# Altium schematic sheet Sensor.SchDoc
size A4
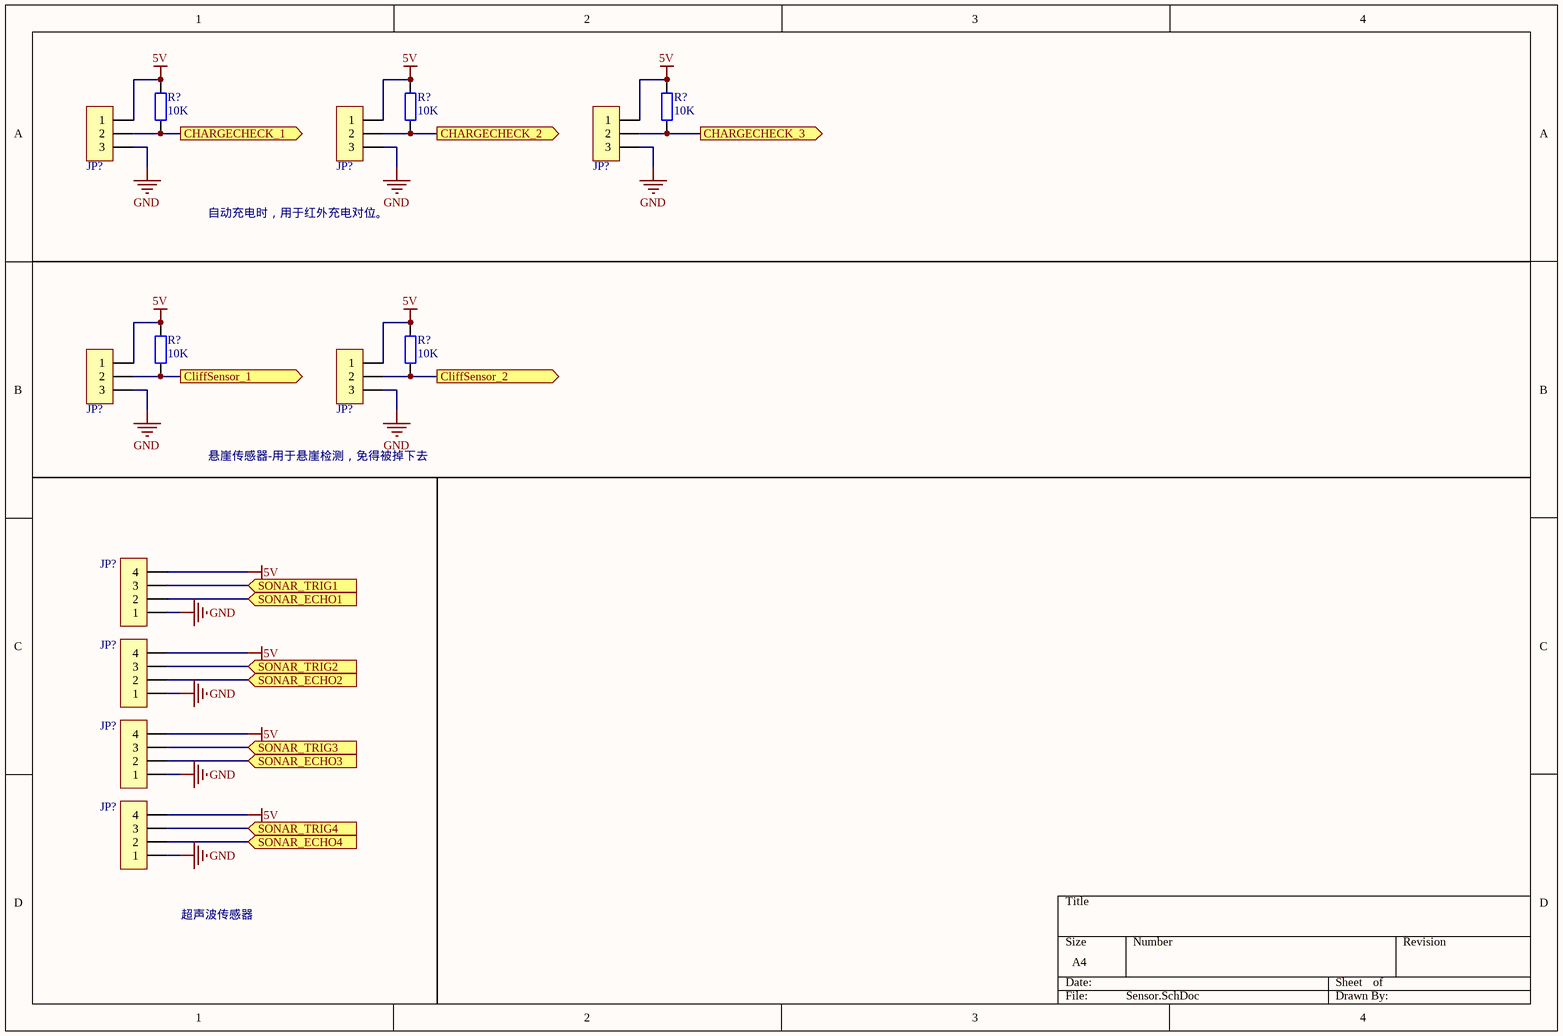
[diagram p0: Sensor.SchDoc]

## Parts
(Parts that share a designator on the sheet are numbered #1, #2 ... from top to bottom, then left to right.)
JP?#1  HDR-1X3  [XH2.54-LI-3P]  (value not drawn)
JP?#2  HDR-1X3  [XH2.54-LI-3P]  (value not drawn)
JP?#3  HDR-1X3  [XH2.54-LI-3P]  (value not drawn)
JP?#4  HDR-1X3  [XH2.54-LI-3P]  (value not drawn)
JP?#5  HDR-1X3  [XH2.54-LI-3P]  (value not drawn)
JP?#6  HDR-1X4  [XH2.54-LI-4P]  (value not drawn)
JP?#7  HDR-1X4  [XH2.54-LI-4P]  (value not drawn)
JP?#8  HDR-1X4  [XH2.54-LI-4P]  (value not drawn)
JP?#9  HDR-1X4  [XH2.54-LI-4P]  (value not drawn)
R?#1  10K  [R 0603_M]
R?#2  10K  [R 0603_M]
R?#3  10K  [R 0603_M]
R?#4  10K  [R 0603_M]
R?#5  10K  [R 0603_M]

## Ports
CHARGECHECK_1 (out), CHARGECHECK_2 (out), CHARGECHECK_3 (out), CliffSensor_1 (out), CliffSensor_2 (out), SONAR_ECHO1 (in), SONAR_ECHO2 (in), SONAR_ECHO3 (in), SONAR_ECHO4 (in), SONAR_TRIG1 (in), SONAR_TRIG2 (in), SONAR_TRIG3 (in), SONAR_TRIG4 (in)

## Nets
5V: JP?#1.1 JP?#2.1 JP?#3.1 JP?#4.1 JP?#5.1 JP?#6.4 JP?#7.4 JP?#8.4 JP?#9.4 R?#1.2 R?#2.2 R?#3.2 R?#4.2 R?#5.2
GND: JP?#1.3 JP?#2.3 JP?#3.3 JP?#4.3 JP?#5.3 JP?#6.1 JP?#7.1 JP?#8.1 JP?#9.1
CHARGECHECK_1: JP?#1.2 R?#1.1 ; port CHARGECHECK_1
CHARGECHECK_2: JP?#2.2 R?#2.1 ; port CHARGECHECK_2
CHARGECHECK_3: JP?#3.2 R?#3.1 ; port CHARGECHECK_3
CliffSensor_1: JP?#4.2 R?#4.1 ; port CliffSensor_1
CliffSensor_2: JP?#5.2 R?#5.1 ; port CliffSensor_2
SONAR_ECHO1: JP?#6.2 ; port SONAR_ECHO1
SONAR_ECHO2: JP?#7.2 ; port SONAR_ECHO2
SONAR_ECHO3: JP?#8.2 ; port SONAR_ECHO3
SONAR_ECHO4: JP?#9.2 ; port SONAR_ECHO4
SONAR_TRIG1: JP?#6.3 ; port SONAR_TRIG1
SONAR_TRIG2: JP?#7.3 ; port SONAR_TRIG2
SONAR_TRIG3: JP?#8.3 ; port SONAR_TRIG3
SONAR_TRIG4: JP?#9.3 ; port SONAR_TRIG4

## Notes on the sheet
- 自动充电时，用于红外充电对位。
- 悬崖传感器-用于悬崖检测，免得被掉下去
- 超声波传感器

## Library data of the parts
JP?#1-JP?#5 = Header 3: 3P接插件; 版权归属: 源创客; BOM名称: 3P接插件; 学习资源: www.ooocke.com
JP?#6-JP?#9 = Header 4: 4P接插件; 版权归属: 源创客; BOM名称: 4P接插件; 学习资源: www.ooocke.com
R?#1-R?#5 = R: 贴片电阻; 版权归属: 源创客; BOM名称: 贴片电阻; 学习资源: www.ooocke.com